# EAGLE design untitled (EAGLE 9.6.2)
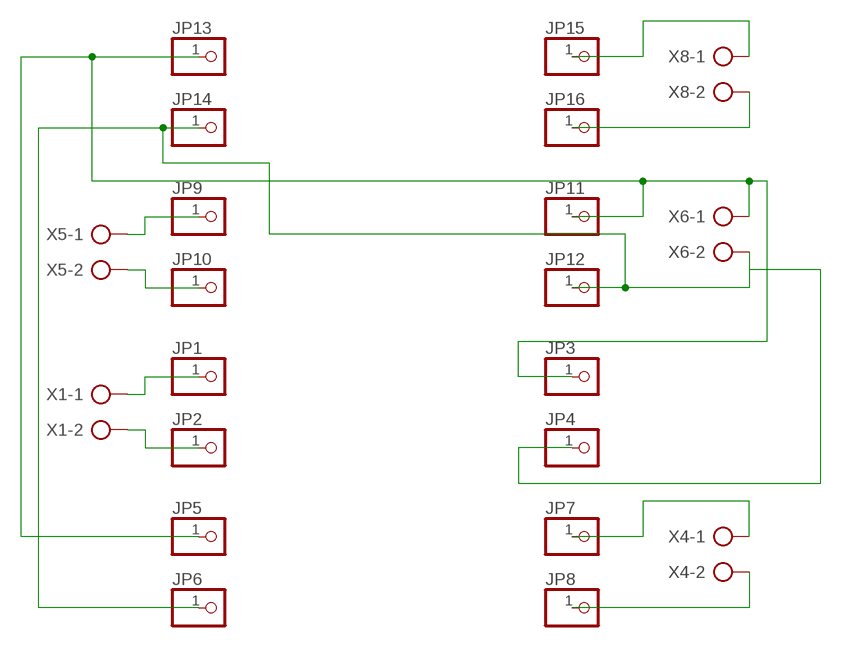
[diagram p0: schematic, sheet 1]

## Parts
JP1  PINHD-1X1  [1X01]
JP2  PINHD-1X1  [1X01]
JP3  PINHD-1X1  [1X01]
JP4  PINHD-1X1  [1X01]
JP5  PINHD-1X1  [1X01]
JP6  PINHD-1X1  [1X01]
JP7  PINHD-1X1  [1X01]
JP8  PINHD-1X1  [1X01]
JP9  PINHD-1X1  [1X01]
JP10  PINHD-1X1  [1X01]
JP11  PINHD-1X1  [1X01]
JP12  PINHD-1X1  [1X01]
JP13  PINHD-1X1  [1X01]
JP14  PINHD-1X1  [1X01]
JP15  PINHD-1X1  [1X01]
JP16  PINHD-1X1  [1X01]
X1  AK500/2-H  [AK500/2-H]
X4  AK500/2-H  [AK500/2-H]
X5  AK500/2-H  [AK500/2-H]
X6  AK500/2-H  [AK500/2-H]
X8  AK500/2-H  [AK500/2-H]

## Nets
N$1: JP1.1 X1.1
N$2: JP2.1 X1.2
N$3: JP3.1 JP5.1 JP11.1 JP13.1 X6.1
N$4: JP4.1 JP6.1 JP12.1 JP14.1 X6.2
N$7: JP7.1 X4.1
N$8: JP8.1 X4.2
N$9: JP9.1 X5.1
N$10: JP10.1 X5.2
N$15: JP15.1 X8.1
N$16: JP16.1 X8.2

## Library data of the parts
JP1-JP16 = adafruit:PINHD-1X1: Pin header 1x1 for 0.1" spacing With round pins
X1 X4-X6 X8 = con-ptr500:AK500/2-H: CONNECTOR Aug. 2004 / PTR Meßtechnik: Die Bezeichnung der Serie AK505 wurde geändert. Es handelt sich hierbei um AK500 in horizontaler Ausführung.; OC_FARNELL: unknown; OC_NEWARK: unknown

## Board
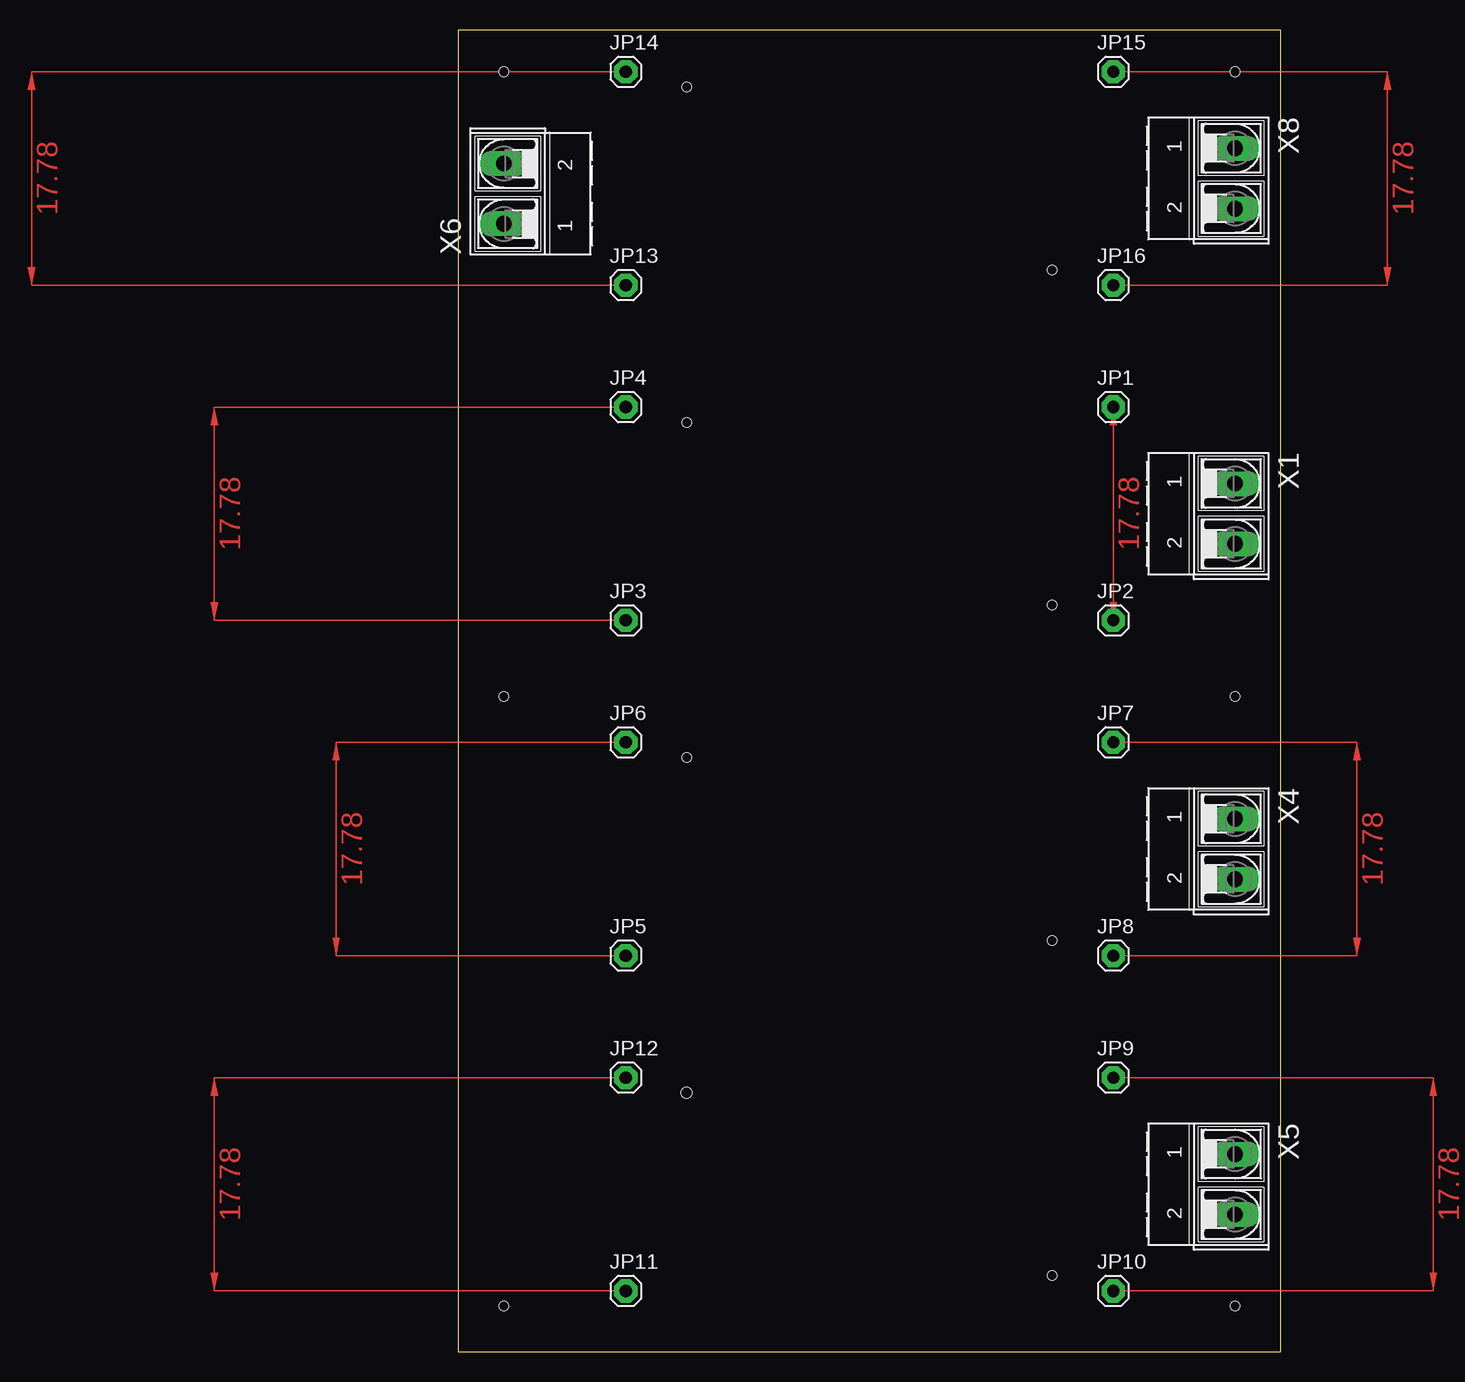
[diagram p1: board, top side]
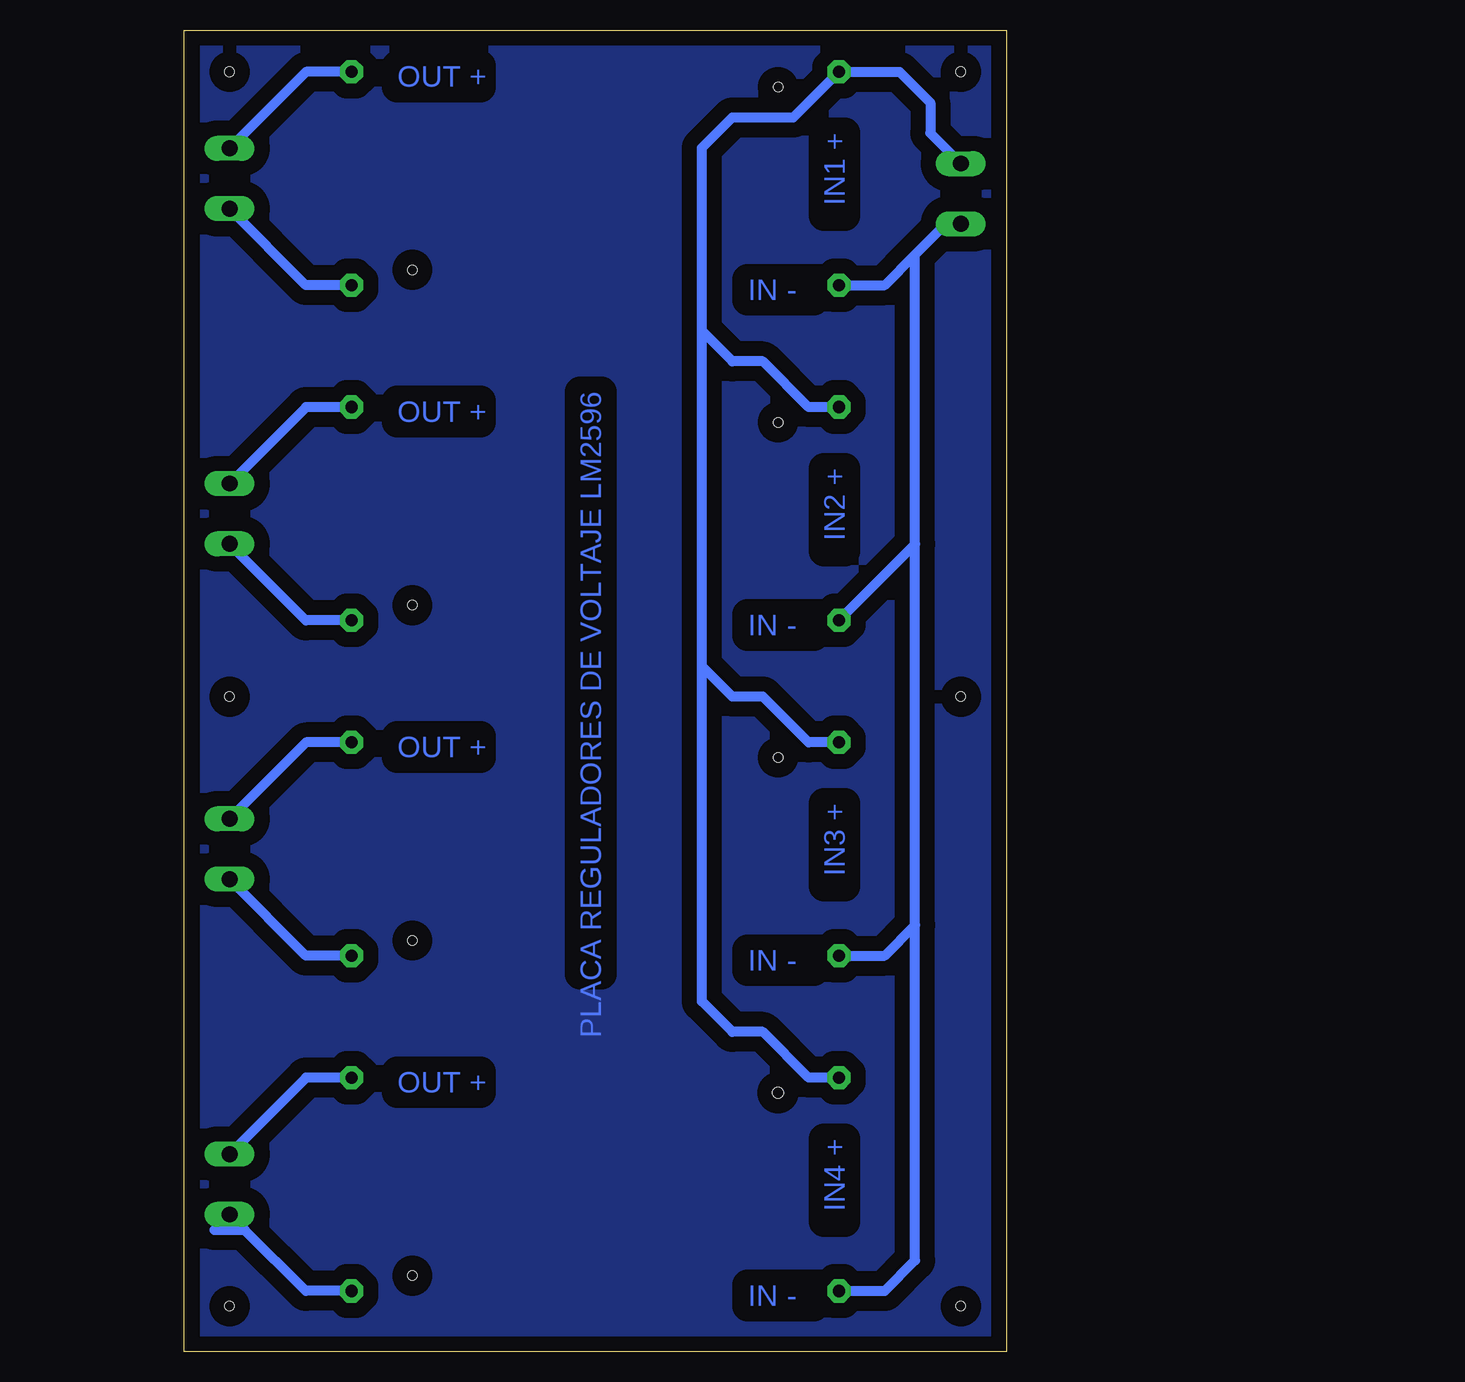
[diagram p2: board, bottom side, seen from below]

Size 68.56 x 110.16 mm. Coordinates in mm from the lower left corner, seen from the top.
Outline: 0,0 68.56,0 68.56,110.16 0,110.16 0,0
Copper layers (1*16): Top 0.035mm / dielectric 1.5mm / Bottom 0.035mm
Design rules "default *": minimum track width 6mil, minimum drill 0.35mm, track to track 6mil, track to pad 6mil, pad to pad 6mil, via to via 6mil, smd to smd 6mil, copper to edge 40mil, drill to drill 20mil, minimum pad ring 15mil, minimum via ring 8mil, stop-mask expansion 4mil, vias tented up to drill 0mil, thermal gap 10mil
Holes 0.78 mm at 19.05,77.47 49.53,90.17 19.05,49.53 49.53,34.29 49.53,62.23 49.53,6.35 19.05,105.41 3.81,3.81 3.81,54.61 3.81,106.68 64.77,3.81 64.77,54.61 64.77,106.68
Holes 0.9 mm at 19.05,21.59

### Footprints (pad centres in the part's own frame; a part is rotated, then mirrored left to right if it is on the bottom)
1X01 = drill 1.016 pad 1.93 octagon: 1 0,0
AK500/2-H = drill 1.321 long: 1 -2.515,0; 2 2.515,0

### Placement (x,y rotation side)
JP1  54.61,78.74 0 top
JP2  54.61,60.96 0 top
JP3  13.97,60.96 0 top
JP4  13.97,78.74 0 top
JP5  13.97,33.02 0 top
JP6  13.97,50.8 0 top
JP7  54.61,50.8 0 top
JP8  54.61,33.02 0 top
JP9  54.61,22.86 0 top
JP10  54.61,5.08 0 top
JP11  13.97,5.08 0 top
JP12  13.97,22.86 0 top
JP13  13.97,88.9 0 top
JP14  13.97,106.68 0 top
JP15  54.61,106.68 0 top
JP16  54.61,88.9 0 top
X1  64.77,69.85 270 top
X4  64.77,41.91 270 top
X5  64.77,13.97 270 top
X6  3.81,96.52 90 top
X8  64.77,97.79 270 top

### Tracks (layer width: path | path; a pad name or v marks a point on that pad's centre or on a via)
F
  pour Bottom (isolate 1.27): 1.27,109.22 1.27,1.27 67.31,1.27 67.31,109.22 2.54,109.22
N$1
  Bottom 0.813: JP1.1 58.39,78.74 X1.1
N$2
  Bottom 0.813: JP2.1 58.42,60.96 64.77,67.31 X1.2
N$3
  Bottom 0.813: 7.62,91.44 5.05,94 X6.1 | JP11.1 10.16,5.08 7.62,7.62 7.62,35.56 | 7.62,67.31 7.62,91.44 | JP5.1 10.16,33.02 7.62,35.56 | JP13.1 10.16,88.9 7.62,91.44 | JP3.1 7.62,67.31 | 7.62,35.56 7.62,67.31
N$4
  Bottom 0.813: X6.2 6.35,101.57 6.35,104.12 8.92,106.68 JP14.1 17.78,102.87 22.86,102.87 25.4,100.33 25.4,85.09 | 25.4,57.15 25.4,85.09 | JP12.1 16.51,22.86 20.32,26.67 22.86,26.67 25.4,29.21 25.4,57.15 | JP6.1 16.51,50.8 20.32,54.61 22.86,54.61 25.4,57.15 | JP4.1 16.51,78.74 20.32,82.55 22.86,82.55 25.4,85.09
N$7
  Bottom 0.813: X4.1 58.39,50.8 JP7.1
N$8
  Bottom 0.813: JP8.1 58.42,33.02 64.77,39.37 X4.2
N$9
  Bottom 0.813: JP9.1 58.39,22.86 X5.1
N$10
  Bottom 0.813: JP10.1 58.42,5.08 63.5,10.16 66.04,10.16 64.77,11.43 X5.2
N$15
  Bottom 0.813: JP15.1 58.39,106.68 X8.1
N$16
  Bottom 0.813: X8.2 64.77,95.25 58.42,88.9 JP16.1
(copper drawn outside any net)
  shapes: Top area x8

### Text on the board
Bottom: OUT + | IN1 + | IN - | PLACA REGULADORES DE VOLTAJE LM2596 | OUT + | IN2 + | IN - | OUT + | IN3 + | IN - | OUT + | IN4 + | IN -